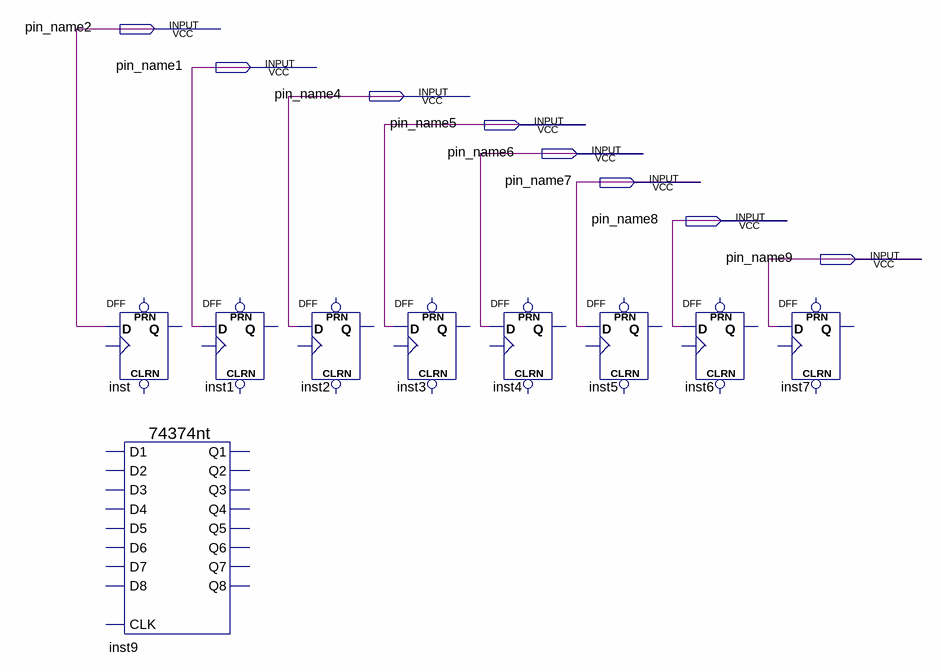
[diagram p0: schematic sheet]
// Quartus schematic Cofre.bdf as structural Verilog: 9 symbols, 8 pins
module Cofre (
  input  pin_name2,
  input  pin_name1,
  input  pin_name4,
  input  pin_name5,
  input  pin_name6,
  input  pin_name7,
  input  pin_name8,
  input  pin_name9
);

  DFF inst (.D(pin_name2));  // open: CLRN, CLK, PRN, Q
  \74374nt  inst9 ();  // open: D3, D2, D1, D7, D6, D4, D5, D8, CLK, Q8, Q7, Q6, Q3, Q4, Q5, Q1, Q2
  DFF inst1 (.D(pin_name1));  // open: CLRN, CLK, PRN, Q
  DFF inst2 (.D(pin_name4));  // open: CLRN, CLK, PRN, Q
  DFF inst3 (.D(pin_name5));  // open: CLRN, CLK, PRN, Q
  DFF inst4 (.D(pin_name6));  // open: CLRN, CLK, PRN, Q
  DFF inst5 (.D(pin_name7));  // open: CLRN, CLK, PRN, Q
  DFF inst6 (.D(pin_name8));  // open: CLRN, CLK, PRN, Q
  DFF inst7 (.D(pin_name9));  // open: CLRN, CLK, PRN, Q
endmodule
